# Altium schematic sheet USB2514 REGULATOR.SchDoc
size A4; DocumentNumber: 5; SheetNumber: 5; SheetTotal: 6
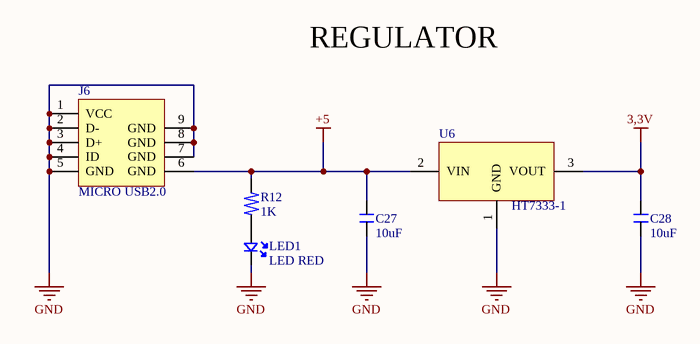
[diagram p0: USB2514 REGULATOR.SchDoc]

## Parts
C27  10uF  [CAPC3216X10N-1206]
C28  10uF  [CAPC3216X10N-1206]
J6  MICRO USB2.0  [USB_CON_10118192-0001LF_SMD]
LED1  LED RED  [LED_0603]
R12  1K  [RESC1608X06N-0603]
U6  HT7333-1  [SOT89-150P350X150-3N]

## Nets
3,3V: C28.2 U6.3(VOUT)
+5: C27.2 J6.6(GND) R12.2 U6.2(VIN)
GND: C27.1 C28.1 J6.1(VCC) J6.2(D-) J6.3(D+) J6.4(ID) J6.5(GND) J6.7(GND) J6.8(GND) J6.9(GND) LED1.C U6.1(GND)
NetLED1_A: LED1.A R12.1

## Notes on the sheet
- REGULATOR

## Library data of the parts
C27 C28 = CAP_1206_22uF
J6 = USB_CON-10118192-0002LF-SMD: USB - micro B USB 2.0 Receptacle Connector 5 Position Surface Mount, Right Angle; Manufacturer: Amphenol ICC (FCI); Manufacturing Part Number: 10118192-0002LF; Case/Package: SMD; Supplier-1: Digikey; Supplier Part Number-1: 609-5379-1-ND
LED1 = LED_RED_0603
R12 = RES_0603_1K
U6 = HT7333-1: HT7333-1 / 30V, 250mA TinyPowerTM LDO